# EAGLE schematic hp6060bv1.5 (EAGLE 9.5.1)
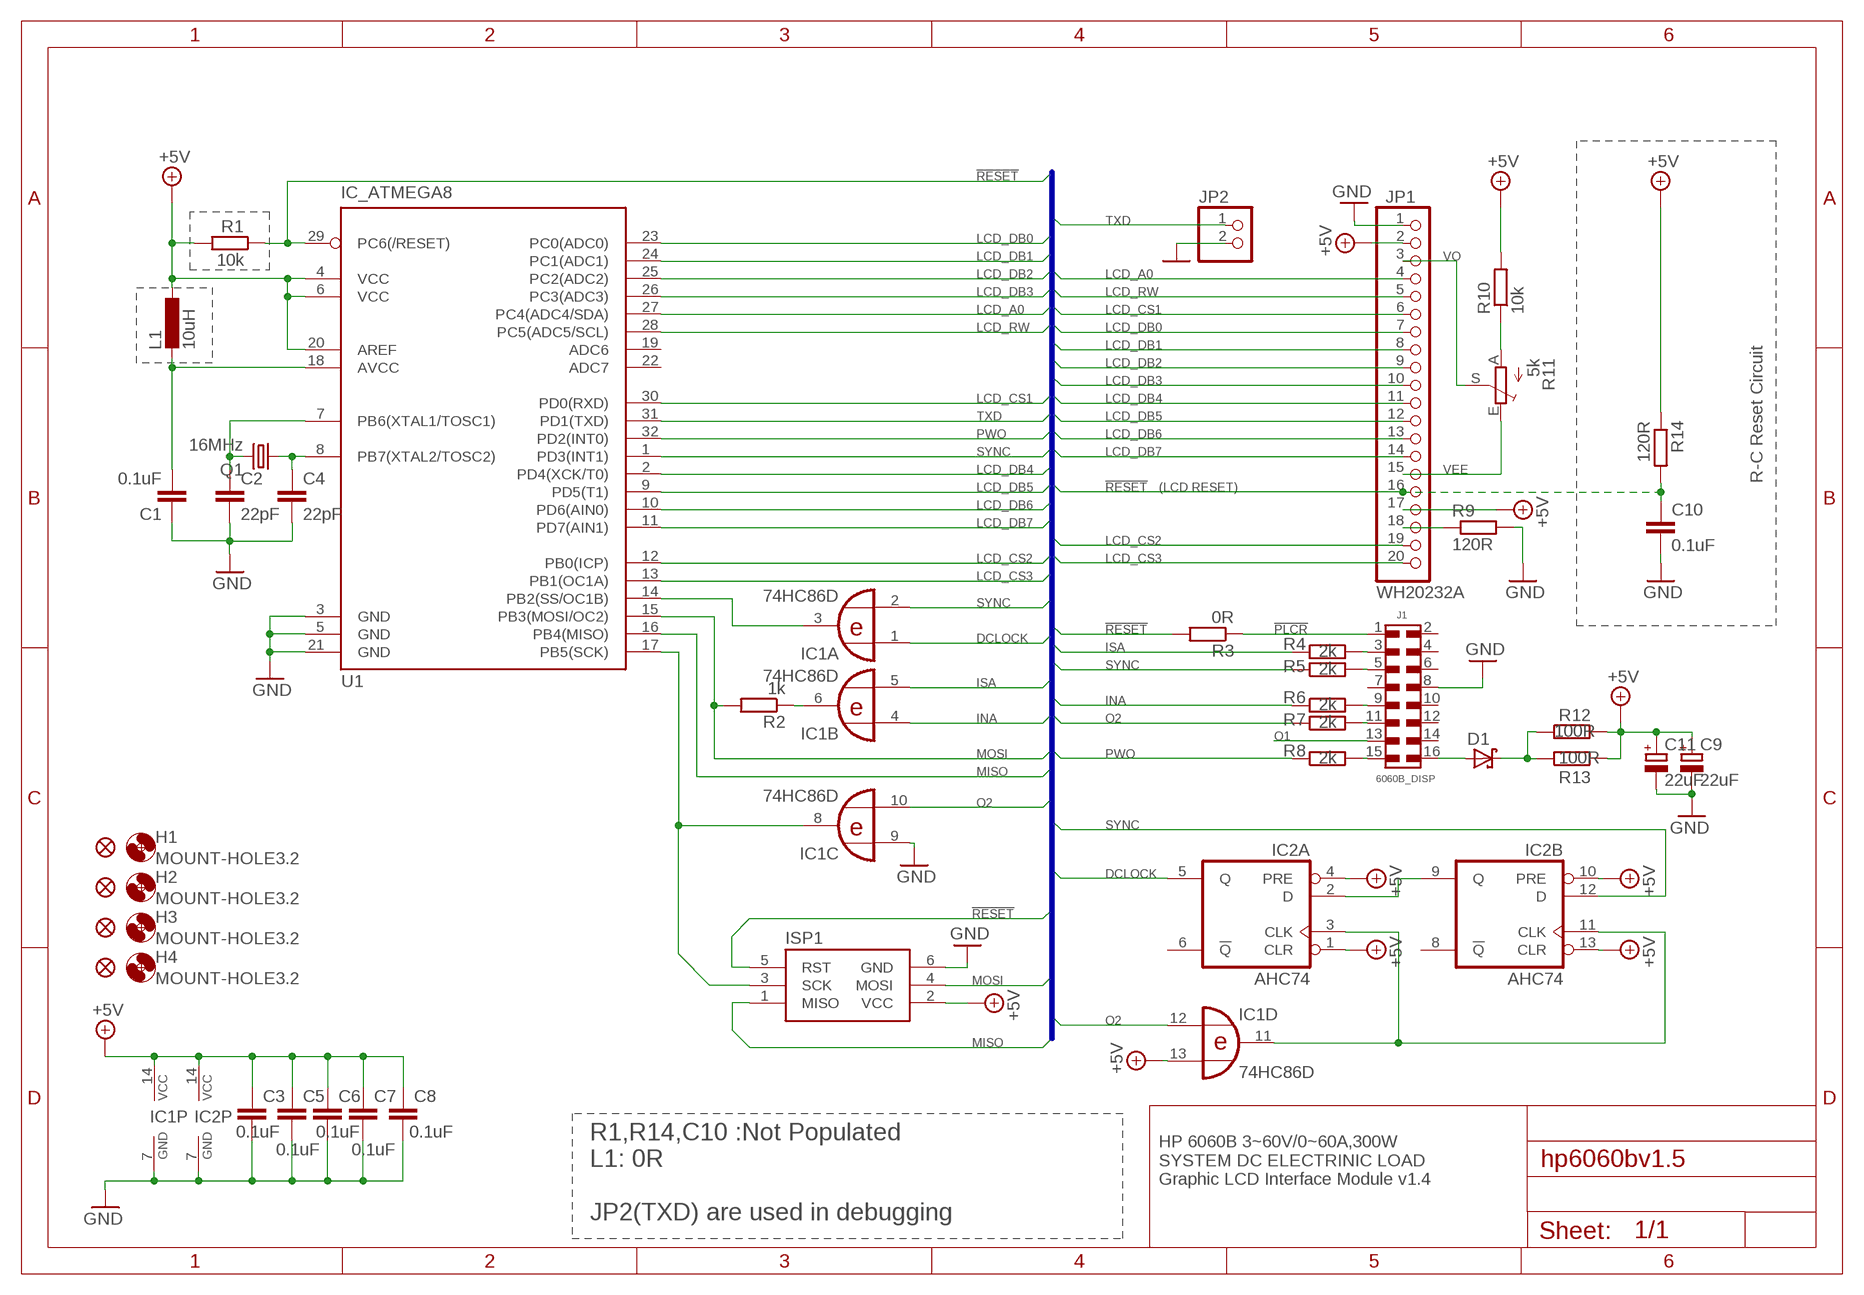
[diagram p0: schematic, sheet 1]

## Parts
C1  0.1uF  C-EUC1206  [C1206]
C2  22pF  C-EUC0603  [C0603]
C3  0.1uF  C-EUC1206  [C1206]
C4  22pF  C-EUC0603  [C0603]
C5  0.1uF  C-EUC1206  [C1206]
C6  0.1uF  C-EUC0805  [C0805]
C7  0.1uF  C-EUC0805  [C0805]
C8  0.1uF  C-EUC1206  [C1206]
C9  22uF  CPOL-EUCT7343  [CT7343]
C10  0.1uF  C-EUC0805  [C0805]
C11  22uF  CPOL-EUCT7343  [CT7343]
D1  SCHOTTKY-DIODE  [DIODE_SMB]
FID1  PCB_FIDUCIALROUND  [PASS-ROUND]
FID2  PCB_FIDUCIALROUND  [PASS-ROUND]
FID3  PCB_FIDUCIALROUND  [PASS-ROUND]
FID4  PCB_FIDUCIALROUND  [PASS-ROUND]
H1  MOUNT-HOLE3.2  [3,2]
H2  MOUNT-HOLE3.2  [3,2]
H3  MOUNT-HOLE3.2  [3,2]
H4  MOUNT-HOLE3.2  [3,2]
IC1  74HC86D  [SO14]
IC2  AHC74  IC_HC74  [TSSOP-14]
ISP1  AVRISP-6  [AVRISP]
J1  6060B_DISP  6100XX21121_61001621121  [61001621121]
JP1  WH20232A  HEADER-1X20ROUND  [1X20_ROUND]
JP2  HEADER-1X2ROUND  [1X02_ROUND]
L1  10uH  L-EUL3225M  [L3225M]
Q1  16MHz  CSM-7X-DU  [CSM-7X-DU]
R1  10k  R-EU_R1206  [R1206]
R2  1k  R-EU_R1206  [R1206]
R3  0R  R-EU_R1206  [R1206]
R4  2k  R-EU_R1206  [R1206]
R5  2k  R-EU_R1206  [R1206]
R6  2k  R-EU_R1206  [R1206]
R7  2k  R-EU_R1206  [R1206]
R8  2k  R-EU_R1206  [R1206]
R9  120R  R-EU_R1206  [R1206]
R10  10k  R-EU_R1206  [R1206]
R11  5k  TRIM_EU-B25P  [B25P]
R12  100R  R-EU_R1206  [R1206]
R13  100R  R-EU_R1206  [R1206]
R14  120R  R-EU_R0805  [R0805]
U1  IC_ATMEGA8  [LQFP32]

## Nets
!PLCR: J1.1 R3.1
!RESET: C10.1 ISP1.5(RST) JP1.16 R1.1 R3.2 R14.2 U1.29(PC6(/RESET))
!SS: IC1.3(A:O) U1.14(PB2(SS/OC1B))
+5V: C3.1 C5.1 C6.1 C7.1 C8.1 C9.+ C11.+ IC1.13(D:I1) IC1.14(P:VCC) IC2.1(A:CLR) IC2.4(A:PRE) IC2.10(B:PRE) IC2.13(B:CLR) IC2.14(P:VCC) ISP1.2(VCC) JP1.2 JP1.17 L1.1 R1.2 R10.2 R12.2 R13.2 R14.1 U1.4(VCC) U1.6(VCC) U1.20(AREF)
AVCC: C1.2 L1.2 U1.18(AVCC)
DCLOCK: IC1.1(A:I0) IC2.5(A:Q)
GND: C1.1 C2.2 C3.2 C4.2 C5.2 C6.2 C7.2 C8.2 C9.- C10.2 C11.- IC1.7(P:GND) IC1.9(C:I0) IC2.7(P:GND) ISP1.6(GND) J1.8 JP1.1 JP2.2 R9.2 U1.3(GND) U1.5(GND) U1.21(GND)
INA: IC1.4(B:I0) R6.1
ISA: IC1.5(B:I1) R4.1
K: JP1.18 R9.1
LCD_A0: JP1.4 U1.27(PC4(ADC4/SDA))
LCD_CS1: JP1.6 U1.30(PD0(RXD))
LCD_CS2: JP1.19 U1.12(PB0(ICP))
LCD_CS3: JP1.20 U1.13(PB1(OC1A))
LCD_DB0: JP1.7 U1.23(PC0(ADC0))
LCD_DB1: JP1.8 U1.24(PC1(ADC1))
LCD_DB2: JP1.9 U1.25(PC2(ADC2))
LCD_DB3: JP1.10 U1.26(PC3(ADC3))
LCD_DB4: JP1.11 U1.2(PD4(XCK/T0))
LCD_DB5: JP1.12 U1.9(PD5(T1))
LCD_DB6: JP1.13 U1.10(PD6(AIN0))
LCD_DB7: JP1.14 U1.11(PD7(AIN1))
LCD_RW: JP1.5 U1.28(PC5(ADC5/SCL))
MISO: ISP1.1(MISO) U1.16(PB4(MISO))
MOSI: ISP1.4(MOSI) R2.2 U1.15(PB3(MOSI/OC2))
N$1: IC1.11(D:O) IC2.3(A:CLK) IC2.11(B:CLK)
N$2: D1.A(C) J1.16
N$3: R10.1 R11.A
N$4: J1.3 R4.2
N$5: J1.5 R5.2
N$6: D1.C(A) R12.1 R13.1
N$9: J1.9 R6.2
N$10: J1.11 R7.2
N$11: IC2.2(A:D) IC2.9(B:Q)
N$12: J1.15 R8.2
N$15: IC1.6(B:O) R2.1
O1: J1.13
O2: IC1.10(C:I1) IC1.12(D:I0) R7.1
PWO: R8.1 U1.32(PD2(INT0))
SCK: IC1.8(C:O) ISP1.3(SCK) U1.17(PB5(SCK))
SYNC: IC1.2(A:I1) IC2.12(B:D) R5.1 U1.1(PD3(INT1))
TXD: JP2.1 U1.31(PD1(TXD))
VEE: JP1.15 R11.E
VO: JP1.3 R11.S
XTAL1: C2.1 Q1.2 U1.7(PB6(XTAL1/TOSC1))
XTAL2: C4.1 Q1.1 U1.8(PB7(XTAL2/TOSC2))
Unconnected: IC2.6(A:!Q) IC2.8(B:!Q) J1.2 J1.4 J1.6 J1.7 J1.10 J1.12 J1.14 U1.19(ADC6) U1.22(ADC7)

## Buses
DCLOCK,INA,ISA,LCD_A0,LCD_CS1,LCD_CS2,LCD_CS3,LCD_DB0,LCD_DB1,LCD_DB2,LCD_DB3,LCD_DB4,LCD_DB5,LCD_DB6,LCD_DB7,LCD_RW,MISO,MOSI,O2,PWO,!RESET,SCK,!SS,SYNC,TXD

## Notes on the sheet
- R-C Reset Circuit
- (LCD RESET)
- HP 6060B 3~60V/0~60A,300W
  SYSTEM DC ELECTRINIC LOAD
  Graphic LCD Interface Module v1.4
- R1,R14,C10 :Not Populated
  L1: 0R
  
  JP2(TXD) are used in debugging

## Library data of the parts
C1 = rcl:C-EU: CAPACITOR, European symbol
C2-C8 C10 = rcl:C-EU: CAPACITOR, European symbol; SPICEPREFIX: C
C9 C11 = rcl:CPOL-EU: POLARIZED CAPACITOR, European symbol; SPICEPREFIX: C
D1 = eagle-ltspice:SCHOTTKY-DIODE: Schottky Diode; SPICEMODEL: NONE; SPICEPREFIX: D; SPICETYPE: diode
FID1-FID4 = 0My:PCB_FIDUCIAL: Fiducial Alignment Points Various fiducial points for machine vision alignment.
H1-H4 = holes:MOUNT-HOLE: MOUNTING HOLE with drill center marker
IC1 = 74xx-eu:74*86: Quad 2-input EXCLUSIVE-OR (XOR) gate
IC2 = 0My:IC_HC74: Dual D type positive edge triggered FLIP FLOP, preset and clear
ISP1 = 0adafruit:AVRISP: AVR ISP HEADER Standard 6 pin header for AVR programming
J1 = Wurth_Connectors_WR-PHD:6100XX21121_61001621121: WR-PHD 2.54 mm SMT Dual Pin Header ARTICLE PROPERTIES: Pins:4;​ 6;​ 8;​ 10;​ 12;​ 14;​ 16;​ 20;​ 22;​ 24;​ 26;​ 32;​ 34;​ 36 KIND PROPERTIES: Pitch：2.54 mm Quality Class:3 as per CECC 75 301-802 Rows：Dual Gender：Pin Header Type：Straight MATERIAL PROPERTIES: Insulator Material :PA6T Insulator Flammability Rating:UL94 V-0 Contact Material:Copper Alloy Contact Plating:Gold Contact Type:Stamped GENERAL INFORMATION Operating Temperature:-40 up to +125 °C Compliance:Lead free / RoHS ELECTRICAL PROPERTIES: Rated Current:3 A IR 1:3 A Withstanding Voltage:500 V (AC) Contact Resistance:20 mΩ RISO:1000 MΩ CERTIFICATION UL Approval:E323964 PACKAGING PROPERTIES Packaging:Tube <https://katalog.we-online.com/media/images/v2/o33205v209%20Family_WR-PHD_610xxx21121.jpg> Details see: https://katalog.we-online.com/en/em/PHD_2_54_SMT_DUAL_PIN_HEADER_6100XX21121 Updated by Yingchun,Shan 2019-10-18 2019 (C) Würth Elektronik; DATASHEET-URL: https://katalog.we-online.com/em/datasheet/61001621121.pdf; GENDER: Pin Header; IR: 3A; MATES: WR-PHD 2.54mm Angled DualSocket Header/Dual Socket Header/Dual Socket Header Bottom Entry/Dual Socket Header Bottom Entry Large/SMT Dual Socket Header/SMT Dual Socket Header Bottom Entry; PACKAGING: Tube; PART-NUMBER: 61001621121; PINS: 16; ROWS: Dual; TYPE: Straight
JP1 = 0microbuilder:HEADER-1X20
JP2 = 0microbuilder:HEADER-1X2: PIN HEADER
L1 = rcl:L-EU: INDUCTOR, European symbol
Q1 = crystal:CSM-7X-DU: SMD CRYSTAL Source: www.ecsxtal.com .. Crystal 3.6864MHz CSM_7X_DU.PDF; OC_FARNELL: unknown; OC_NEWARK: unknown
R1-R10 R12-R14 = rcl:R-EU_: RESISTOR, European symbol; SPICEPREFIX: R
R11 = pot:TRIM_EU-: POTENTIOMETER
U1 = 0My:IC_ATMEGA8